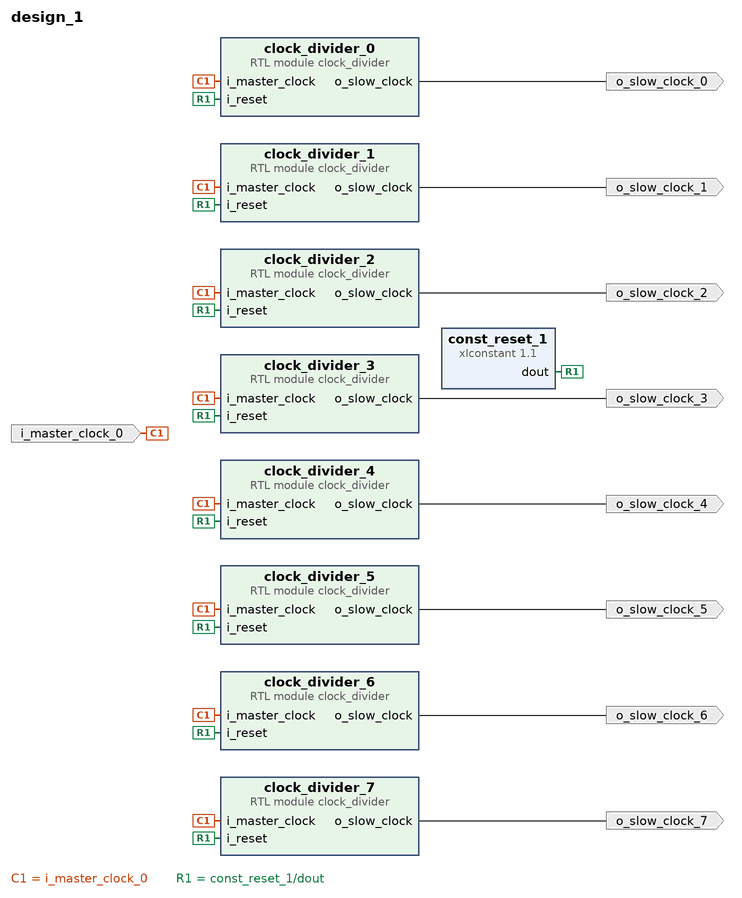
[diagram p0: block diagram of the top level]
# Vivado block design design_1, xc7z020clg484-1, Vivado 2024.2
create_bd_design design_1

create_bd_port -dir O -type clk o_slow_clock_1
create_bd_port -dir I -type clk i_master_clock_0
create_bd_port -dir O -type clk o_slow_clock_0
create_bd_port -dir O -type clk o_slow_clock_2
create_bd_port -dir O -type clk o_slow_clock_3
create_bd_port -dir O -type clk o_slow_clock_4
create_bd_port -dir O -type clk o_slow_clock_5
create_bd_port -dir O -type clk o_slow_clock_6
create_bd_port -dir O -type clk o_slow_clock_7

create_bd_cell -type module -reference clock_divider clock_divider_1
set_property -dict {CONFIG.MASTER_CLOCK_FRQ 1000000000 CONFIG.SLOW_CLOCK_FRQ 9} [get_bd_cells clock_divider_1]
create_bd_cell -type ip -vlnv xilinx.com:ip:xlconstant:1.1 const_reset_1
set_property -dict {CONFIG.CONST_VAL 0} [get_bd_cells const_reset_1]
create_bd_cell -type module -reference clock_divider clock_divider_0
create_bd_cell -type module -reference clock_divider clock_divider_2
set_property -dict {CONFIG.MASTER_CLOCK_FRQ 1000000000 CONFIG.SLOW_CLOCK_FRQ 8} [get_bd_cells clock_divider_2]
create_bd_cell -type module -reference clock_divider clock_divider_3
set_property -dict {CONFIG.MASTER_CLOCK_FRQ 1000000000 CONFIG.SLOW_CLOCK_FRQ 7} [get_bd_cells clock_divider_3]
create_bd_cell -type module -reference clock_divider clock_divider_4
set_property -dict {CONFIG.MASTER_CLOCK_FRQ 1000000000 CONFIG.SLOW_CLOCK_FRQ 6} [get_bd_cells clock_divider_4]
create_bd_cell -type module -reference clock_divider clock_divider_5
set_property -dict {CONFIG.MASTER_CLOCK_FRQ 1000000000 CONFIG.SLOW_CLOCK_FRQ 5} [get_bd_cells clock_divider_5]
create_bd_cell -type module -reference clock_divider clock_divider_6
set_property -dict {CONFIG.MASTER_CLOCK_FRQ 1000000000 CONFIG.SLOW_CLOCK_FRQ 4} [get_bd_cells clock_divider_6]
create_bd_cell -type module -reference clock_divider clock_divider_7
set_property -dict {CONFIG.MASTER_CLOCK_FRQ 1000000000 CONFIG.SLOW_CLOCK_FRQ 3} [get_bd_cells clock_divider_7]

# ---- connections ----

connect_bd_net [get_bd_pins clock_divider_0/o_slow_clock] [get_bd_ports o_slow_clock_0]
connect_bd_net [get_bd_pins clock_divider_1/o_slow_clock] [get_bd_ports o_slow_clock_1]
connect_bd_net [get_bd_pins clock_divider_2/o_slow_clock] [get_bd_ports o_slow_clock_2]
connect_bd_net [get_bd_pins clock_divider_3/o_slow_clock] [get_bd_ports o_slow_clock_3]
connect_bd_net [get_bd_pins clock_divider_4/o_slow_clock] [get_bd_ports o_slow_clock_4]
connect_bd_net [get_bd_pins clock_divider_5/o_slow_clock] [get_bd_ports o_slow_clock_5]
connect_bd_net [get_bd_pins clock_divider_6/o_slow_clock] [get_bd_ports o_slow_clock_6]
connect_bd_net [get_bd_pins clock_divider_7/o_slow_clock] [get_bd_ports o_slow_clock_7]
connect_bd_net -net i_master_clock_0_1 [get_bd_ports i_master_clock_0] \
  [get_bd_pins clock_divider_1/i_master_clock] [get_bd_pins clock_divider_0/i_master_clock] \
  [get_bd_pins clock_divider_2/i_master_clock] [get_bd_pins clock_divider_3/i_master_clock] \
  [get_bd_pins clock_divider_4/i_master_clock] [get_bd_pins clock_divider_5/i_master_clock] \
  [get_bd_pins clock_divider_6/i_master_clock] [get_bd_pins clock_divider_7/i_master_clock]
connect_bd_net -net xlconstant_1_dout [get_bd_pins const_reset_1/dout] \
  [get_bd_pins clock_divider_1/i_reset] [get_bd_pins clock_divider_0/i_reset] [get_bd_pins clock_divider_2/i_reset] \
  [get_bd_pins clock_divider_3/i_reset] [get_bd_pins clock_divider_4/i_reset] [get_bd_pins clock_divider_5/i_reset] \
  [get_bd_pins clock_divider_6/i_reset] [get_bd_pins clock_divider_7/i_reset]

validate_bd_design
save_bd_design
